# Altium schematic sheet LED.SchDoc: Led Interface
size A4; SheetNumber: 7; SheetTotal: 10; Project: WSN Z1; Comments: Led Interface
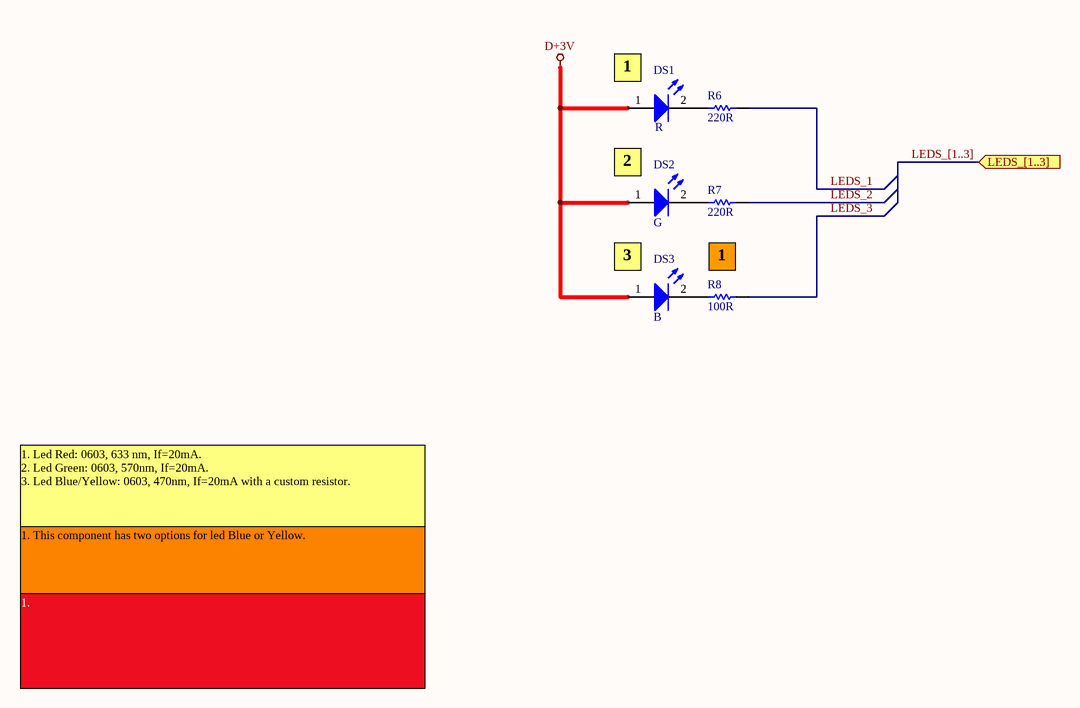
[diagram p0: LED.SchDoc]

## Parts
DS1  R  [LED0603]
DS2  G  [LED0603]
DS3  B  [LED0603]
R6  value 220R  [CR-0402-AL]  (hidden comment: Res Semi)
R7  value 220R  [CR-0402-AL]  (hidden comment: Res Semi)
R8  value 100R  [CR-0402-AL]  (hidden comment: Res Semi)

## Ports
LEDS_[1..3] (in)

## Nets
D+3V: DS1.1(A) DS2.1(A) DS3.1(A)
LEDS_1: R6.1
LEDS_2: R7.2
LEDS_3: R8.2
NetDS1_2: DS1.2(K) R6.2
NetDS2_2: DS2.2(K) R7.1
NetDS3_2: DS3.2(K) R8.1

## Buses and harness runs
bus LEDS_[1..3] = port LEDS_[1..3]

## Notes on the sheet
- (near DS1) 1
- 2
- 3
- 1
- 1. Led Red: 0603, 633 nm, If=20mA.
  2. Led Green: 0603, 570nm, If=20mA.
  3. Led Blue/Yellow: 0603, 470nm, If=20mA with a custom resistor.
- 1. This component has two options for led Blue or Yellow.
- 1.

## Library data of the parts
DS1 = LED2: LED 1.6X0.8MM 631NM RED CLR SMD
DS2 = LED2: LED CHIPLED 570NM GREEN 0603 SMD
DS3 = LED2: LED 1.6X0.8MM 470NM BLUE CLR SMD
R6-R8 = Res Semi: Semiconductor Resistor; Manufacturer: Generic Components